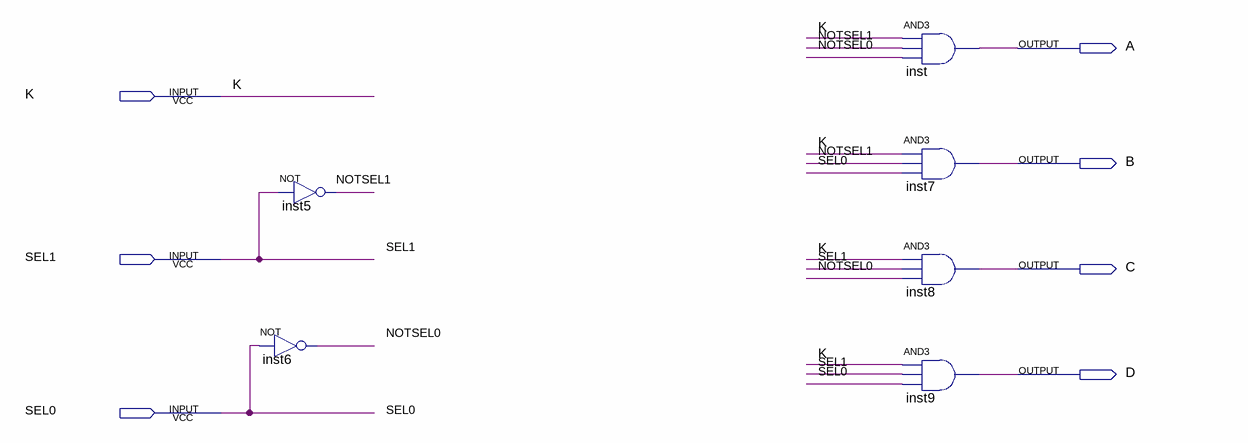
[diagram p0: schematic sheet]
// Quartus schematic DEMUX14.bdf as structural Verilog: 6 symbols, 7 pins
module DEMUX14 (
  input  K,
  input  SEL1,
  input  SEL0,
  output A,
  output B,
  output C,
  output D
);

  wire NOTSEL0, NOTSEL1;

  not inst6 (NOTSEL0, SEL0);
  not inst5 (NOTSEL1, SEL1);
  and inst (A, K, NOTSEL1, NOTSEL0);
  and inst7 (B, K, NOTSEL1, SEL0);
  and inst8 (C, K, SEL1, NOTSEL0);
  and inst9 (D, K, SEL1, SEL0);
endmodule
